# Altium schematic sheet midi.SchDoc: MIDI Interface
size A4; Organization: heig-vd; Address1: heig-vd; Address2: Route de Cheseaux 1; Address3: 1401 Yverdon-les-Bains; Address4: Suisse; DocumentNumber: 7; Revision: 1.1; SheetNumber: 7; SheetTotal: 12
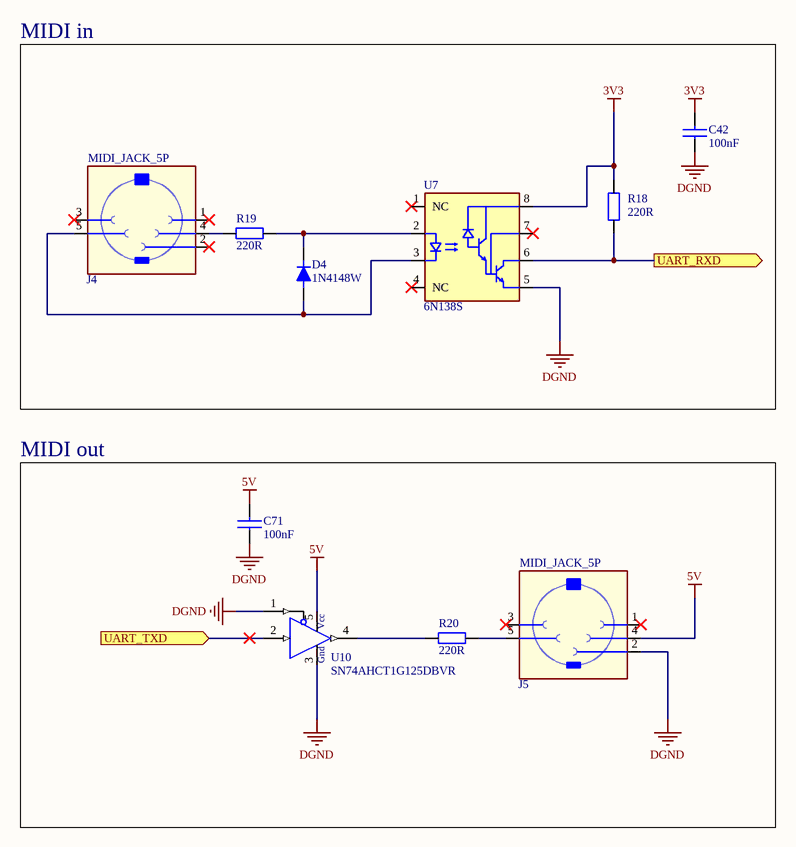
[diagram p0: midi.SchDoc]

## Parts
C42  100nF  [SM/C_0603]
C71  100nF  [SM/C_0603]
D4  value 1N4148W  [SM/D_SOD123-A1C2]  (hidden comment: Diode/A1C2)
J4  MIDI_JACK_5P  [CUI SDS-50J MiniDIN]
J5  MIDI_JACK_5P  [CUI SDS-50J MiniDIN]
R18  220R  [SM/R_0603]
R19  220R  [SM/R_0603]
R20  220R  [SM/R_0603]
U7  6N138S  [SDIP-8]
U10  SN74AHCT1G125DBVR  [SOT23-5]

## Blocks framed on the sheet
MIDI in: C42 D4 J4 R18 R19 U7
MIDI out: C71 J5 R20 U10

## Ports
UART_RXD (out), UART_TXD (in)

## Nets
3V3: C42.2 R18.1 U7.8(ALIM)
5V: C71.2 J5.4 U10.5(VCC)
DGND: C42.1 C71.1 J5.2 U7.5(GND) U10.1(~{OE}) U10.3(GND)
UART_RXD: R18.2 U7.6(Vo) ; port UART_RXD
UART_TXD: U10.2(A) ; port UART_TXD
NetD4_1: D4.1(A) J4.5 U7.3(IN-)
NetD4_2: D4.2(C) R19.2 U7.2(IN+)
NetJ4_4: J4.4 R19.1
NetJ5_5: J5.5 R20.2
NetR20_1: R20.1 U10.4(Y)

Not connected (* = marked no-connect by the designer): J4 1* 2* 3*; J5 1* 3*; U7 1(NC)* 4(NC)* 7(Vb)*

## Notes on the sheet
- Route de Cheseaux 1
- CH-1401 Yverdon-les-Bains
- Titre:
- Date:
- Projet:
- Revision:
- Sheet
- of
- File:
- (in symbol SN74AHCT1G125DBVR) Vcc; Gnd

## Library data of the parts
C42 C71 = 182: Ceramic multi-layer; Manufacturer: AVX; Manufacturer P/N: 0603YC104KAZ2A; ID: 182; Voltage: 16V; Tolerance: ±10%; Value: 100nF; Component Type: Capacitor, non-polarized; Supplier 1: Farnell; Supplier Part Number 1: 7569556; RoHS Compliant: True
D4 = 2165: DIODE SWITCH 100V 0.15A; Manufacturer: Diodes Inc; Manufacturer P/N: 1N4148W-7-F; ID: 2165; Component Type: Diode; Case: SOD123; Supplier 1: Digi-Key; Supplier Part Number 1: 1N4148W-FDICT-ND; Supplier 2: Mouser; Supplier Part Number 2: 621-1N4148W-F; RoHS Compliant: True; ComponentLink1Description: Datasheet; ComponentLink1URL: http://www.mouser.com/ds/2/115/ds30086-60872.pdf; ComponentLink2Description: Supplier; ComponentLink2URL: http://www.digikey.fr/product-detail/fr/1N4148W-7-F/1N4148W-FDICT-ND/815280
J4 J5 = 349: Connecteur MIDI Jack 5 pôles; Manufacturer: CUI; Manufacturer P/N: SDS-50J; ID: 349; Component Type: Connecteur MIDI; Connector Type: MIDI_JACK 5P; Supplier 1: Digi-Key; Supplier Part Number 1: CP-2350-ND; Supplier 2: Mouser; Supplier Part Number 2: 490-SDS-50J; RoHS Compliant: False; ComponentLink1Description: Datasheet; ComponentLink1URL: http://www.mouser.com/ds/2/670/sds-xxj-535158.pdf; ComponentLink2Description: Supplier; ComponentLink2URL: http://www.mouser.ch/ProductDetail/CUI-Inc/SDS-50J/?qs=%2fha2pyFaduggidGgKudcyKY%252bmRS6WBKWhhDnjWUtbvs%3d; RoHS Compliant1: False
R18-R20 = 93: Résistance 0603 63mW 1% 220R; Manufacturer: Multicomp; Manufacturer P/N: MC 0.036mW 0603 1% 220R; ID: 93; Voltage: 50V; Value: 220R; Component Type: Résistance; Power: 63mW; Tolerance: 1%; Supplier 1: Farnell; Supplier Part Number 1: 9330801; RoHS Compliant: False
U7 = 6N138S: High Speed Optocoupler; Manufacturer: Vishay; Pitch: 2,54mm; Body: 10,16x7,62mm; Component Type: IC; Manufacturer P/N: 6N138S; Category: Ics Opto; Package Type: SOIC-8; Value: 6N138S; RoHS Compliant: True
U10 = SN74AHCT1G125DBVR: Buffers & Line Drivers Tri-State Single Bus; Manufacturer: Texas Instruments; Pitch: 0.65mm; Body: 3.15x2.9x1.3mm; Manufacturer P/N: SN74AHCT1G125DBVR; Category: ICs logiques; Package Type: SOT23-5; Value: SN74AHCT1G125; RoHS Compliant: True; Supplier 1: Digi-Key; Supplier 2: Arrow; Supplier Part Number 1: 296-4708-1-ND; Supplier Part Number 2: VJQlf-JApPy44XOFdhpFsLTwoOIB6Mwfbn24Nxqhtw8